# EAGLE board rekick2015-Prototyp (EAGLE 7.5.0)
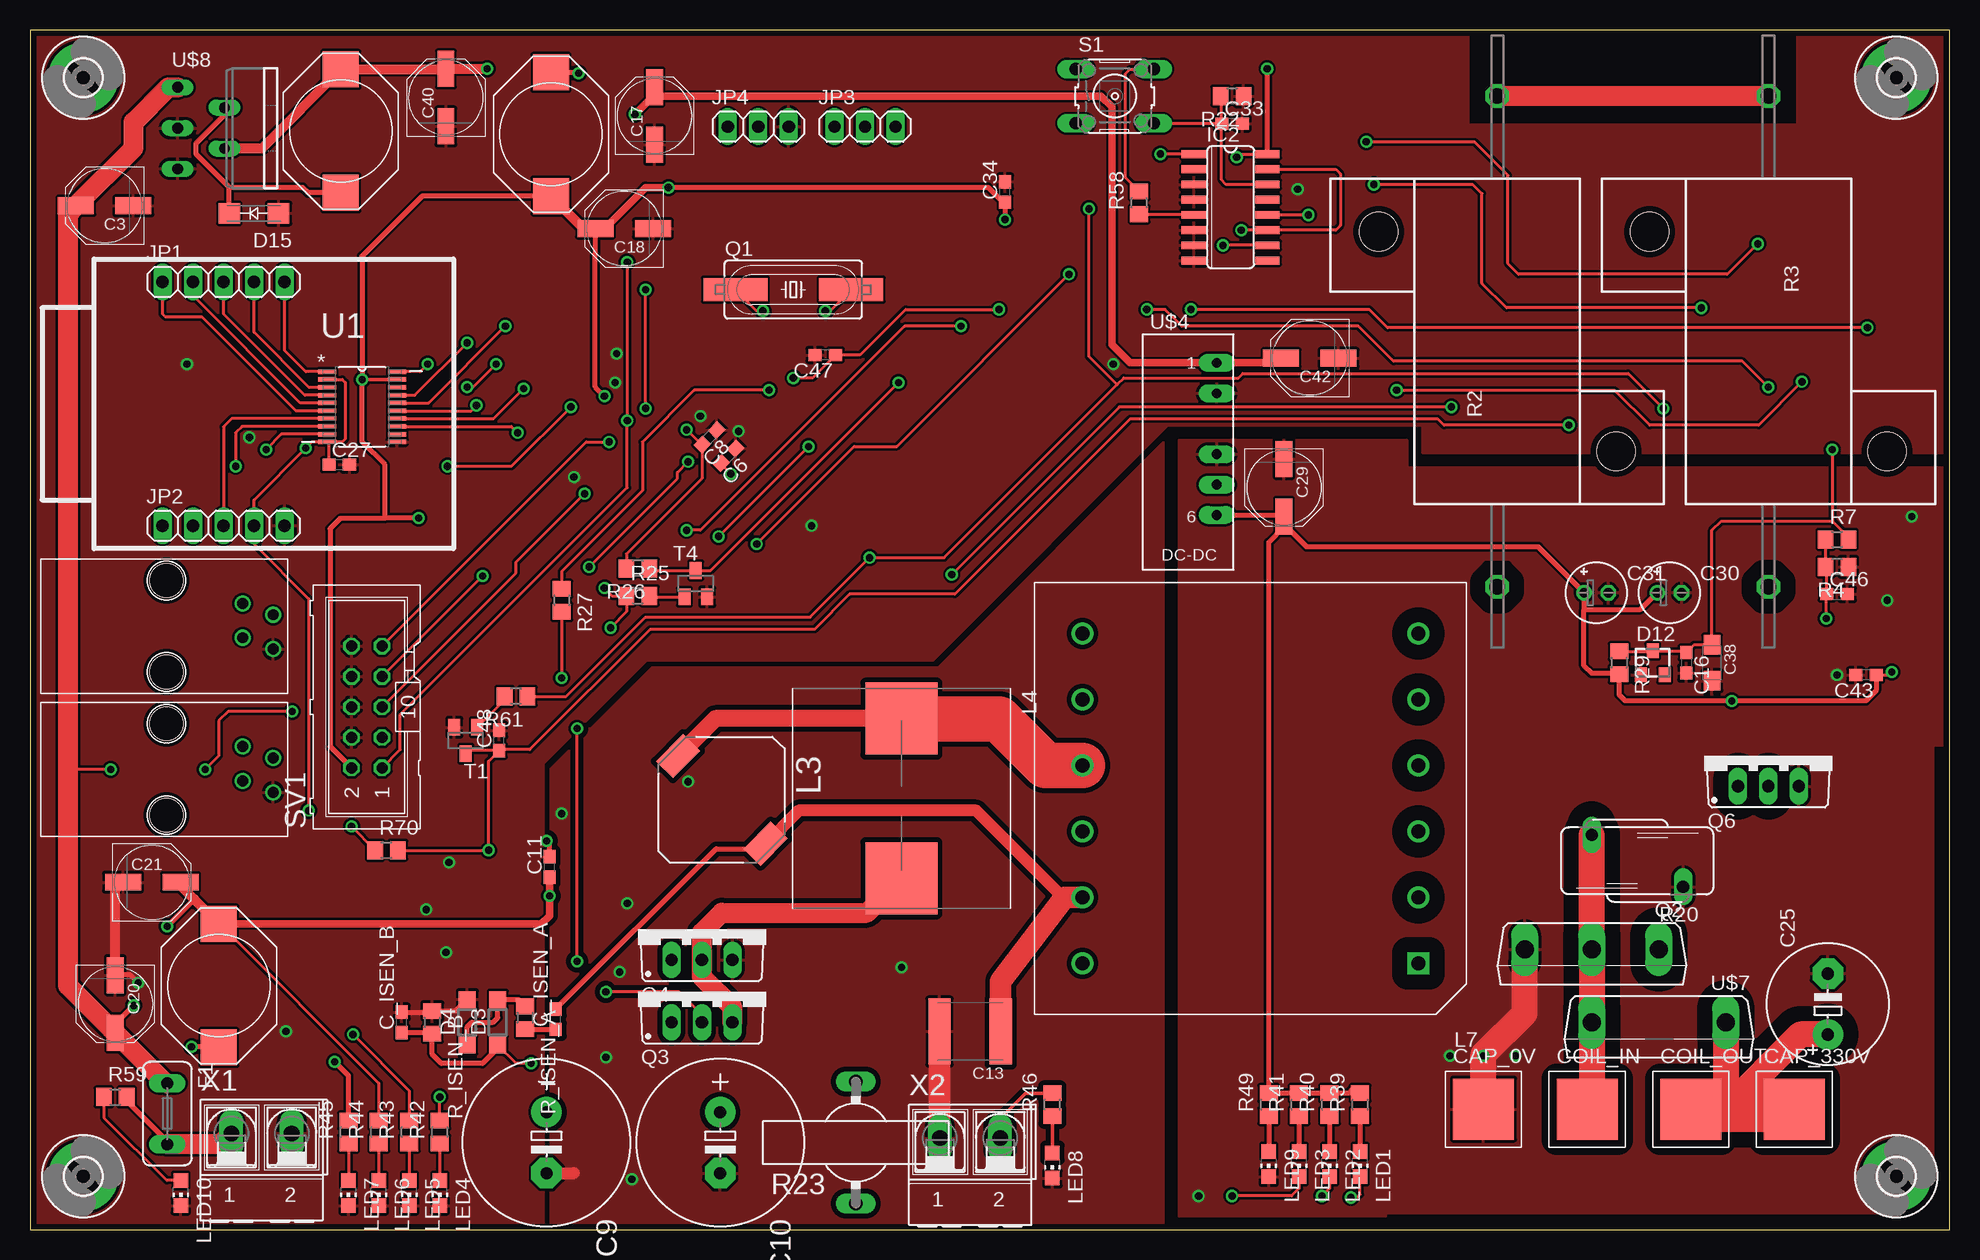
[diagram p7: board, top side]
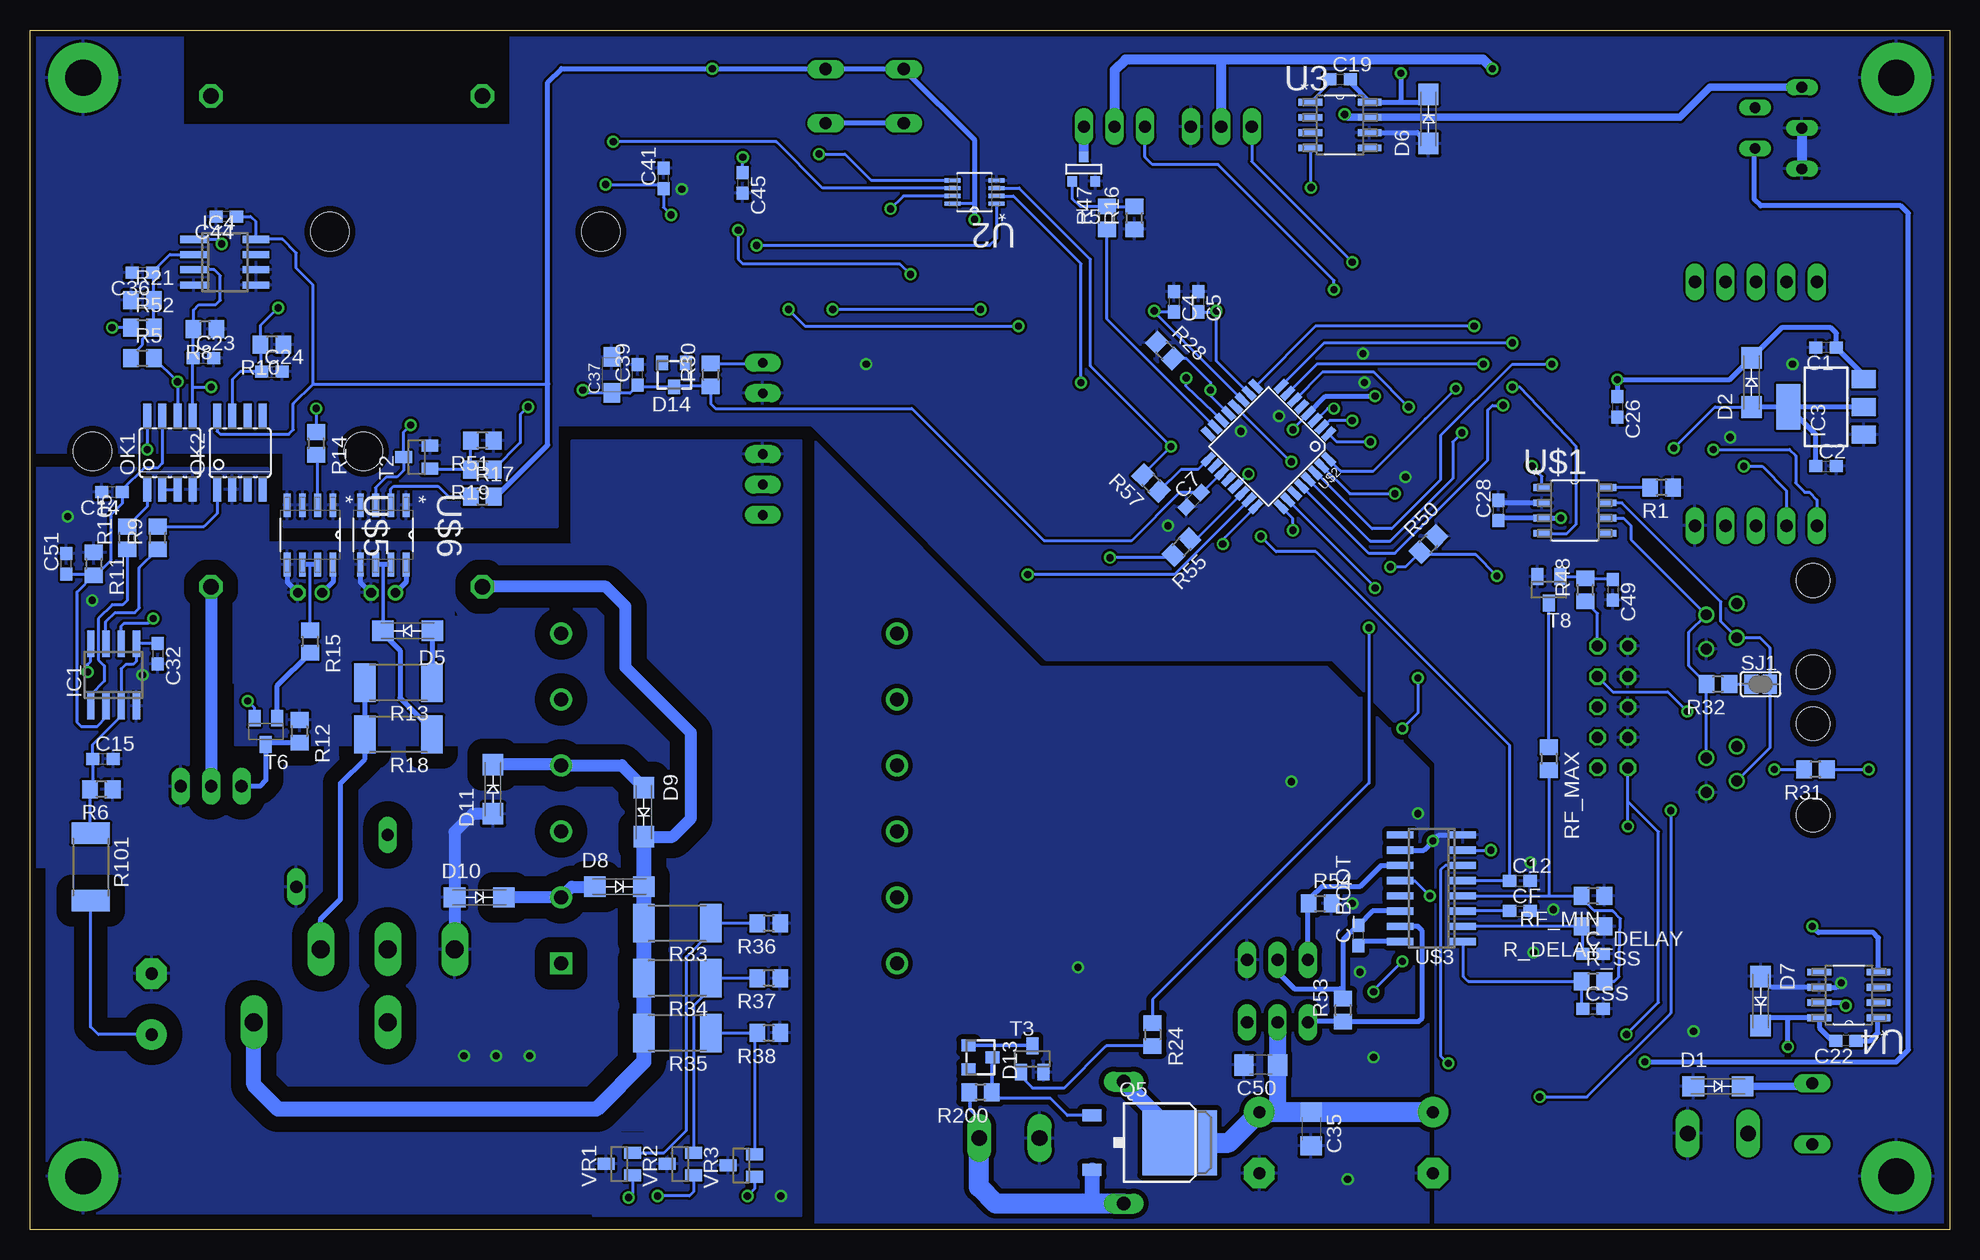
[diagram p8: board, bottom side, seen from below]

Size 160 x 100 mm. Coordinates in mm from the lower left corner, seen from the top.
Outline: 0,0 160,0 160,100 0,100 0,0
Copper layers (1*16): Top 0.035mm / dielectric 1.5mm / Bottom 0.035mm
Design rules "qp_designrules_8mil": minimum track width 8mil, minimum drill 20mil, track to track 8mil, track to pad 8mil, pad to pad 8mil, via to via 8mil, smd to smd 8mil, copper to edge 20mil, drill to drill 20mil, minimum pad ring 8mil, minimum via ring 8mil, stop-mask expansion 2mil, vias tented up to drill 0mil, thermal gap 10mil

## Footprints (pad centres in the part's own frame; a part is rotated, then mirrored left to right if it is on the bottom)
C0603 = smd 1.1 x 1: 1 -0.85,0; 2 0.85,0
PANASONIC_D = smd 3 x 1.4: + 2.4,0; - -2.4,0
E5-13 = drill 1.016 pad 2.54: + -2.54,0 | drill 1.016 pad 2.54 octagon: - 2.54,0
C2220K = smd 1.85 x 5.5: 1 -2.55,0; 2 2.55,0
E5-10,5 = drill 1.016 pad 2.54: + -2.54,0 | drill 1.016 pad 2.54 octagon: - 2.54,0
E2-5 = drill 0.813 pad 1.27: + -1.016,0 | drill 0.813 pad 1.27 octagon: - 1.016,0
C1206 = smd 1.6 x 1.8: 1 -1.4,0; 2 1.4,0
SMC_A = smd 1.6 x 1.4: + -1.5,0; - 1.5,0
5-5 = smd 5.08 x 5.08: P$1 0,0
SMA-DO214AC = smd 1.8 x 1.7: A -2.05,0; K 2.05,0
SOD123 = smd 1.4 x 1.4: A 1.9,0; C -1.9,0
TO236 = smd 1 x 1.2: A -1,-1; C 0,1; NC 1,-1
TE5 = drill 1.016 long: 1 -2.54,0; 2 2.54,0
3,0-PAD = drill 3 pad 5.842: B3,0 0,0
SO08 = smd 0.6 x 2.2: 1 -1.905,-2.6; 2 -0.635,-2.6; 3 0.635,-2.6; 4 1.905,-2.6; 5 1.905,2.6; 6 0.635,2.6; 7 -0.635,2.6; 8 -1.905,2.6
SO16 = smd 0.66 x 2.032: 1 -4.445,-3.073; 2 -3.175,-3.073; 3 -1.905,-3.073; 4 -0.635,-3.073; 5 0.635,-3.073; 6 1.905,-3.073; 7 3.175,-3.073; 8 4.445,-3.073; 9 4.445,3.073; 10 3.175,3.073; 11 1.905,3.073; 12 0.635,3.073; 13 -0.635,3.073; 14 -1.905,3.073; 15 -3.175,3.073; 16 -4.445,3.073
SOT223 = smd 1.5 x 2: 1 -2.3,-3.15; 2 0,-3.15; 3 2.3,-3.15 | smd 3.8 x 2: 4 0,3.15
1X05 = drill 1.016 long: 1 -5.08,0; 2 -2.54,0; 3 0,0; 4 2.54,0; 5 5.08,0
1X03 = drill 1.016 long: 1 -2.54,0; 2 0,0; 3 2.54,0
PISM = smd 3 x 3: 1 -5.15,0; 2 5.15,0
IND_ELLATP-B = smd 2 x 3.2 rotated 45: 1 -3.65,-3.65; 2 3.65,3.65
WE-HCI_1890 = smd 6 x 6: 1 -6.65,0; 2 6.65,0
WE-LLCR_ETD34 = drill 1.2 square: 1 -14,13.75 | drill 1.2: 2 -14,8.25; 3 -14,2.75; 4 -14,-2.75; 5 -14,-8.25; 6 -14,-13.75; 7 14,-13.75; 8 14,-8.25; 9 14,-2.75; 10 14,2.75; 11 14,8.25; 12 14,13.75
CHIP-LED0805 = smd 1.2 x 1.2: A 0,-1.05; C 0,1.05
SOIC08 = smd 0.66 x 2.032: 1 -1.905,-3.073; 2 -0.635,-3.073; 3 0.635,-3.073; 4 1.905,-3.073; 5 1.905,3.073; 6 0.635,3.073; 7 -0.635,3.073; 8 -1.905,3.073
HC49UP = smd 5.334 x 1.93: 1 -4.826,0; 2 4.826,0
TO247BV = drill 1.499 long: D 0,-2.921; G -5.588,-2.921; S 5.588,-2.921
TO220BV = drill 1.016 long: D 0,-2.54; G -2.54,-2.54; S 2.54,-2.54
D-PAK_TO252AA = smd 1 x 1.6: 1 -2.28,-4.8; 3 2.28,-4.8 | smd 5.4 x 6.2: 4 0,2.5
R0805 = smd 1.3 x 1.5: 1 -0.95,0; 2 0.95,0
HS25 = drill 1.3 octagon: 1 -20.47,0; 2 20.47,0 | hole 3.2: 9.15,9.9; -9.15,-9.9
R2512 = smd 1.8 x 3.2: 1 -2.8,0; 2 2.8,0
S10K385 = drill 1.016 long: 1 -2.159,-3.81; 2 2.159,3.81
N644A = drill 1.118 long: 1 -5.08,0; 2 5.08,0
RJ10 = drill 0.9: P$1 -1.905,6.55; P$2 -0.953,9.09; P$3 0.953,6.55; P$4 1.905,9.09 | hole 2.8: -3.81,0.2; 3.81,0.2
B3F-10XX = drill 1.016 long: 1 -3.251,2.261; 2 3.251,2.261; 3 -3.251,-2.261; 4 3.251,-2.261
SJ = smd 1.168 x 1.6: 1 -0.762,0; 2 0.762,0
ML10 = drill 0.914 octagon: 1 -5.08,-1.27; 2 -5.08,1.27; 3 -2.54,-1.27; 4 -2.54,1.27; 5 0,-1.27; 6 0,1.27; 7 2.54,-1.27; 8 2.54,1.27; 9 5.08,-1.27; 10 5.08,1.27
SOT23 = smd 1 x 1.4: 1 -0.95,-1.1; 2 0.95,-1.1; 3 0,1.1
SOT-23 = smd 0.787 x 0.889: 1 0.025,-1.016; 2 -0.94,1.016; 3 0.991,1.016
SOT23-BEC = smd 1 x 1.4: B -0.95,-1.1; C 0,1.1; E 0.95,-1.1
SOP65P640X120-20N = smd 1.473 x 0.356: 1 -2.921,2.921; 2 -2.921,2.286; 3 -2.921,1.626; 4 -2.921,0.965; 5 -2.921,0.33; 6 -2.921,-0.33; 7 -2.921,-0.965; 8 -2.921,-1.626; 9 -2.921,-2.286; 10 -2.921,-2.921; 11 2.921,-2.921; 12 2.921,-2.286; 13 2.921,-1.626; 14 2.921,-0.965; 15 2.921,-0.33; 16 2.921,0.33; 17 2.921,0.965; 18 2.921,1.626; 19 2.921,2.286; 20 2.921,2.921
SOP65P400X130-8N = smd 1.321 x 0.356: 1 -1.829,0.965; 2 -1.829,0.33; 3 -1.829,-0.33; 4 -1.829,-0.965; 5 1.829,-0.965; 6 1.829,-0.33; 7 1.829,0.33; 8 1.829,0.965
SOIC127P620X175-8N = smd 1.981 x 0.559: 1 -2.464,1.905; 2 -2.464,0.635; 3 -2.464,-0.635; 4 -2.464,-1.905; 5 2.464,-1.905; 6 2.464,-0.635; 7 2.464,0.635; 8 2.464,1.905
SOIC127P600X175-8N = smd 1.473 x 0.559: 1 -2.718,1.905; 2 -2.718,0.635; 3 -2.718,-0.635; 4 -2.718,-1.905; 5 2.718,-1.905; 6 2.718,-0.635; 7 2.718,0.635; 8 2.718,1.905
TQFP32-08 = smd 1.27 x 0.559: 1 -4.293,2.8; 2 -4.293,2; 3 -4.293,1.2; 4 -4.293,0.4; 5 -4.293,-0.4; 6 -4.293,-1.2; 7 -4.293,-2; 8 -4.293,-2.8; 17 4.293,-2.8; 18 4.293,-2; 19 4.293,-1.2; 20 4.293,-0.4; 21 4.293,0.4; 22 4.293,1.2; 23 4.293,2; 24 4.293,2.8 | smd 0.559 x 1.27: 9 -2.8,-4.293; 10 -2,-4.293; 11 -1.2,-4.293; 12 -0.4,-4.293; 13 0.4,-4.293; 14 1.2,-4.293; 15 2,-4.293; 16 2.8,-4.293; 25 2.8,4.293; 26 2,4.293; 27 1.2,4.293; 28 0.4,4.293; 29 -0.4,4.293; 30 -1.2,4.293; 31 -2,4.293; 32 -2.8,4.293
SO16' = smd 0.6 x 2.2: 1 -4.445,-2.6; 2 -3.175,-2.6; 3 -1.905,-2.6; 4 -0.635,-2.6; 5 0.635,-2.6; 6 1.905,-2.6; 7 3.175,-2.6; 8 4.445,-2.6; 9 4.445,2.6; 10 3.175,2.6; 11 1.905,2.6; 12 0.635,2.6; 13 -0.635,2.6; 14 -1.905,2.6; 15 -3.175,2.6; 16 -4.445,2.6
TMH-D = drill 0.8 pad 1.5 long: 1 0,6.35; 2 0,3.81; 4 0,-1.27; 5 0,-3.81; 6 0,-6.35
SOIC-8 = smd 1.981 x 0.559: 1 -2.464,1.905; 2 -2.464,0.635; 3 -2.464,-0.635; 4 -2.464,-1.905; 5 2.464,-1.905; 6 2.464,-0.635; 7 2.464,0.635; 8 2.464,1.905
TO247AD = drill 1.499 long: A 5.588,-2.921; C -5.588,-2.921
TO220511 = drill 0.9 long: 1 -3.4,-8.4; 2 -1.7,-4.5; 3 0,-8.4; 4 1.7,-4.5; 5 3.4,-8.4
AK500/2-H = drill 1.321 long: 1 -2.515,0; 2 2.515,0

## Placement (x,y rotation side)
C1  10µ/10V  [C0603]  10.29,73.53 180 bottom
C2  10µ/10V  [C0603]  10.29,63.63 0 bottom
C3  47µ/35V  [PANASONIC_D]  6.22,85.34 180 top
C4  22p  [C0603]  64.64,77.34 270 bottom
C5  22p  [C0603]  62.61,77.34 270 bottom
C6  100n  [C0603]  58.2,64.5 225 top
C7  100n  [C0603]  62.99,60.83 45 bottom
C8  100n  [C0603]  56.64,66.04 225 top
C9  2200µ/50V  [E5-13]  43.05,7.24 270 top
C10  2200µ/50V  [E5-13]  57.53,7.24 270 top
C11  100n  [C0603]  43.31,30.23 90 top
C12  100n  [C0603]  35.81,29.08 0 bottom
C13  2.2µ/250V  [C2220K]  78.36,16.51 180 top
C14  100n  [C0603]  153.16,61.47 180 bottom
C15  100n  [C0603]  153.92,39.24 0 bottom
C16  100n  [C0603]  138.05,47.24 270 top
C17  47µ/35V  [PANASONIC_D]  52.07,92.84 90 top
C18  47µ/35V  [PANASONIC_D]  49.53,83.44 180 top
C19  10n/35V  [C0603]  50.8,95.89 0 bottom
C20  47µ/35V  [PANASONIC_D]  7.11,18.8 270 top
C21  47µ/35V  [PANASONIC_D]  10.16,28.96 0 top
C22  10n/35V  [C0603]  8.64,15.75 180 bottom
C23  100n  [C0603]  145.54,72.64 0 bottom
C24  100n  [C0603]  139.83,71.5 0 bottom
C25  10µ/450V  [E5-10,5]  149.86,18.8 90 top
C26  100n  [C0603]  27.69,68.58 270 bottom
C27  100n  [C0603]  25.78,63.75 0 top
C28  100n  [C0603]  37.59,59.94 90 bottom
C29  47µ/35V  [PANASONIC_D]  104.52,61.85 270 top
C30  47µ/35V  [E2-5]  136.65,53.09 0 top
C31  47µ/35V  [E2-5]  130.56,53.09 0 top
C32  100n  [C0603]  149.35,48.01 270 bottom
C33  100n  [C0603]  100.2,92.2 0 top
C34  100n  [C0603]  81.28,86.49 90 top
C35  1µ/50V  [C1206]  53.21,8.38 270 bottom
C36  100n  [C0603]  150.62,79.76 180 bottom
C37  1µ/25V  [SMC_A]  111.51,71.25 90 bottom
C38  1µ/25V  [SMC_A]  140.21,47.24 270 top
C39  100n  [C0603]  109.35,71.25 90 bottom
C40  47µ/35V  [PANASONIC_D]  34.67,94.36 90 top
C41  100n  [C0603]  107.19,87.63 90 bottom
C42  47µ/35V  [PANASONIC_D]  106.68,72.64 180 top
C43  100n  [C0603]  153.03,46.23 180 top
C44  100n  [C0603]  143.64,84.45 180 bottom
C45  100n  [C0603]  100.58,87.25 270 bottom
C46  100n  [C0603]  150.62,52.96 0 top
C47  100n  [C0603]  66.29,72.9 180 top
C48  100n  [C0603]  39.12,40.77 90 top
C49  10µ/10V  [C0603]  28.07,53.34 270 bottom
C50  1µ/50V  [C1206]  57.4,13.72 180 bottom
C51  100n  [C0603]  156.97,55.5 90 bottom
C_BOOT  100n  [C0603]  49.28,24.51 90 bottom
C_DELAY  10µ/10V  [C0603]  29.72,22.99 0 bottom
C_ISEN_A  22n/50V  [C0603]  43.81,17.53 90 top
C_ISEN_B  62n/10V  [C0603]  30.99,17.27 90 top
CAP_0V  WIREPADSMD5-5  [5-5]  121.16,10.03 270 top
CAP_330V  WIREPADSMD5-5  [5-5]  147.07,10.03 270 top
CF  470p  [C0603]  35.81,26.54 0 bottom
COIL_IN  WIREPADSMD5-5  [5-5]  129.79,10.03 270 top
COIL_OUT  WIREPADSMD5-5  [5-5]  138.43,10.03 270 top
CSS  1µ/10V  [C0603]  29.72,18.41 0 bottom
D1  ES1A  [SMA-DO214AC]  19.3,11.94 0 bottom
D2  ES1A  [SMA-DO214AC]  16.51,70.61 90 bottom
D3  MBR0520LT  [SOD123]  38.99,17.27 90 top
D4  MBR0520LT  [SOD123]  36.45,17.27 90 top
D5  ES1A  [SMA-DO214AC]  128.52,49.91 180 bottom
D6  ES1A  [SMA-DO214AC]  43.43,92.58 90 bottom
D7  ES1A  [SMA-DO214AC]  15.75,19.05 270 bottom
D8  STTH1R06A  [SMA-DO214AC]  110.87,28.57 0 bottom
D9  STTH1R06A  [SMA-DO214AC]  108.84,34.8 270 bottom
D10  STTH1R06A  [SMA-DO214AC]  122.56,27.69 0 bottom
D11  STTH1R06A  [SMA-DO214AC]  121.41,36.7 90 bottom
D12  BZX84-A5V1  [TO236]  135.25,47.24 0 top
D13  SMD ZD 12  [TO236]  80.77,14.35 270 bottom
D14  BZX84-A5V1  [TO236]  106.3,71.25 180 bottom
D15  ES1A  [SMA-DO214AC]  18.67,84.71 180 top
F1  FUSETE5  [TE5]  11.43,9.65 270 top
H1  MOUNT-PAD-ROUND3.0  [3,0-PAD]  155.57,4.45 0 top
H2  MOUNT-PAD-ROUND3.0  [3,0-PAD]  155.57,96.01 0 top
H3  MOUNT-PAD-ROUND3.0  [3,0-PAD]  4.45,96.01 0 top
H4  MOUNT-PAD-ROUND3.0  [3,0-PAD]  4.45,4.45 0 top
IC1  LM1458D  [SO08]  153.03,46.23 0 bottom
IC2  4043D  [SO16]  100.08,85.22 270 top
IC3  LM1117  [SOT223]  10.29,68.58 90 bottom
IC4  LM1458D  [SO08]  143.76,80.64 270 bottom
JP1  [1X05]  16.13,78.99 0 top
JP2  [1X05]  16.13,58.67 0 top
JP3  [1X03]  69.6,91.95 0 top
JP4  [1X03]  60.71,91.95 0 top
L1  68µH  [PISM]  25.91,91.57 270 top
L3  3.3UH  [IND_ELLATP-B]  57.66,35.81 270 top
L4  820n  [WE-HCI_1890]  72.64,35.94 270 top
L5  100µH  [PISM]  43.43,91.31 90 top
L6  150µH  [PISM]  15.75,20.32 270 top
L7  WE-LLCR  [WE-LLCR_ETD34]  101.73,35.94 180 top
LED1  [CHIP-LED0805]  110.87,5.46 180 top
LED2  [CHIP-LED0805]  108.33,5.46 180 top
LED3  [CHIP-LED0805]  105.79,5.46 180 top
LED4  [CHIP-LED0805]  34.16,3.05 180 top
LED5  [CHIP-LED0805]  31.62,3.05 180 top
LED6  [CHIP-LED0805]  29.08,3.05 180 top
LED7  [CHIP-LED0805]  26.54,3.05 180 top
LED8  [CHIP-LED0805]  85.22,5.33 180 top
LED9  [CHIP-LED0805]  103.25,5.46 180 top
LED10  [CHIP-LED0805]  12.57,3.05 180 top
OK1  ILD213  [SOIC08]  148.34,64.77 0 bottom
OK2  ILD213  [SOIC08]  142.49,64.77 0 bottom
Q1  16MHz  [HC49UP]  63.63,78.36 0 top
Q2  IGW60T120  [TO247BV]  130.18,20.45 180 top
Q3  IPP023N10N5  [TO220BV]  56.01,19.81 0 top
Q4  IPP023N10N5  [TO220BV]  56.01,25.02 0 top
Q5  IPD90P04P4L  [D-PAK_TO252AA]  66.67,7.24 270 bottom
Q6  IRF840  [TO220BV]  144.91,39.5 0 top
R1  1k  [R0805]  24,61.85 180 bottom
R2  100  [HS25]  122.3,74.04 90 top
R3  100  [HS25]  144.91,74.04 270 top
R4  24k, 1%  [R0805]  150.62,55.24 180 top
R5  10k, 1%  [R0805]  150.62,72.64 0 bottom
R6  12k, 1%  [R0805]  154.05,36.7 180 bottom
R7  5.6k, 1%  [R0805]  150.62,57.53 0 top
R8  10k, 1%  [R0805]  145.41,75.06 180 bottom
R9  2k  [R0805]  149.35,57.66 90 bottom
R10  5,6k  [R0805]  139.83,73.79 180 bottom
R11  10k, 1%  [R0805]  154.69,55.5 270 bottom
R12  10k  [R0805]  137.54,41.53 270 bottom
R13  5  [R2512]  129.29,45.59 180 bottom
R14  390  [R0805]  136.14,65.53 270 bottom
R15  10k  [R0805]  136.65,49.02 270 bottom
R16  50k  [R0805]  67.94,84.33 90 bottom
R17  390  [R0805]  122.3,61.09 0 bottom
R18  5  [R2512]  129.29,41.27 180 bottom
R19  5,6k  [R0805]  122.3,63.37 180 bottom
R20  ERZE07A621  [S10K385]  133.99,30.73 90 top
R21  33k, 1%  [R0805]  150.62,77.47 0 bottom
R22  10k  [R0805]  100.2,94.49 180 top
R23  [N644A]  68.83,7.24 90 top
R24  5,6k  [R0805]  66.42,16.26 270 bottom
R25  100k  [R0805]  50.67,52.83 0 top
R26  50k  [R0805]  50.67,55.12 180 top
R27  50k  [R0805]  44.32,52.45 270 top
R28  5,6k  [R0805]  65.41,73.28 315 bottom
R29  1k  [R0805]  132.46,47.24 270 top
R30  3.3k  [R0805]  103.25,71.25 90 bottom
R31  50k  [R0805]  11.18,38.35 180 bottom
R32  120  [R0805]  19.3,45.47 180 bottom
R33  1M  [R2512]  106.05,25.53 180 bottom
R34  1M  [R2512]  106.05,20.95 180 bottom
R35  1M  [R2512]  106.05,16.38 180 bottom
R36  50k  [R0805]  98.42,25.53 180 bottom
R37  16.9k  [R0805]  98.42,20.95 180 bottom
R38  7.68k  [R0805]  98.42,16.38 180 bottom
R39  4.7k  [R0805]  110.87,10.41 90 top
R40  4.7k  [R0805]  108.33,10.41 90 top
R41  4.7k  [R0805]  105.79,10.41 90 top
R42  680  [R0805]  34.16,8.13 90 top
R43  1,5k  [R0805]  31.62,8.13 90 top
R44  4.7k  [R0805]  29.08,8.13 90 top
R45  1,5k  [R0805]  26.54,8.13 90 top
R46  10k  [R0805]  85.22,10.41 90 top
R47  5,6k  [R0805]  70.23,84.33 90 bottom
R48  5,6k  [R0805]  30.35,53.34 90 bottom
R49  4.7k  [R0805]  103.25,10.41 90 top
R50  5,6k  [R0805]  43.43,57.15 45 bottom
R51  50k  [R0805]  122.3,65.79 180 bottom
R52  5,6k, 1%  [R0805]  150.62,75.18 0 bottom
R53  100k  [R0805]  50.55,18.29 90 bottom
R54  100k  [R0805]  52.45,27.18 0 bottom
R55  5,6k  [R0805]  64.01,56.9 225 bottom
R57  5,6k  [R0805]  66.55,62.23 135 bottom
R58  10k  [R0805]  92.46,85.6 90 top
R59  10k  [R0805]  7.11,11.05 0 top
R61  5,6k  [R0805]  40.51,44.45 180 top
R70  10k  [R0805]  29.72,31.62 0 top
R101  1M, 1%  [R2512]  154.94,30.23 270 bottom
R105  680  [R0805]  151.89,57.66 90 bottom
R200  50k  [R0805]  80.77,11.43 180 bottom
R_DELAY  [R0805]  29.72,25.27 180 bottom
R_ISEN_A  33k  [R0805]  41.27,17.65 270 top
R_ISEN_B  2k  [R0805]  33.53,17.27 270 top
R_SS  3.3k, 1%  [R0805]  29.72,20.7 0 bottom
RF_MAX  33k  [R0805]  33.4,39.24 270 bottom
RF_MIN  12k  [R0805]  29.72,27.81 180 bottom
RJ_1  RJ10  [RJ10]  11.18,38.35 270 top
RJ_2  RJ10  [RJ10]  11.18,50.29 270 top
S1  [B3F-10XX]  90.42,94.49 0 top
SJ1  [SJ]  15.75,45.47 0 bottom
SV1  [ML10]  28.07,43.56 90 top
T1  BC849  [SOT23]  36.32,40.77 180 top
T2  BC849  [SOT23]  127.76,64.39 90 bottom
T3  BC849  [SOT23]  76.45,14.22 0 bottom
T4  BC849  [SOT23]  55.5,53.85 0 top
T5  IRLML6344TRPBF  [SOT-23]  72.14,88.39 180 bottom
T6  BC859  [SOT23-BEC]  140.34,41.53 180 bottom
T8  BC849  [SOT23]  33.4,53.34 180 bottom
U1  TXB0108PWR  [SOP65P640X120-20N]  27.69,68.58 0 top
U2  SN74LVC2G02DCTR  [SOP65P400X130-8N]  81.28,86.49 180 bottom
U3  LM2675  [SOIC127P620X175-8N]  50.8,92.08 0 bottom
U4  LM2675  [SOIC127P620X175-8N]  8.38,19.56 180 bottom
U$1  MCP2551-I/SN  [SOIC127P600X175-8N]  31.24,59.94 0 bottom
U$2  ATMEGA64M1  [TQFP32-08]  56.77,65.28 225 bottom
U$3  L6599  [SO16']  43.18,28.45 90 bottom
U$4  TMH-D  [TMH-D]  98.93,65.91 0 top
U$5  SI8261ABC  [SOIC-8]  136.65,57.91 270 bottom
U$6  SI8261ABC  [SOIC-8]  130.56,57.91 270 bottom
U$7  DSEI30-12A  [TO247AD]  135.76,14.35 180 top
U$8  LM2576  [TO220511]  20.7,91.82 270 top
VR1  TL431_SOT23  [SOT23]  110.87,5.46 90 bottom
VR2  TL431_SOT23  [SOT23]  105.79,5.46 90 bottom
VR3  TL431_SOT23  [SOT23]  100.71,5.33 90 bottom
X1  [AK500/2-H]  19.3,8 0 top
X2  [AK500/2-H]  78.36,7.62 0 top

## Tracks (layer width: path | path; a pad name or v marks a point on that pad's centre or on a via)
24V_PRI  (via drill 0.6)
  Top 0.254: Q3.D 56.01,17.91 54.1,19.81 v48.01,19.81 | v45.59,22.35 v45.59,41.78 | R27.2 v44.32,45.97
  Bottom 0.254: v48.01,19.81 48.01,19.94 v45.59,22.35 | 55.97,13.46 56.01,13.46 C50.1 | v44.32,45.97 44.32,43.05 v45.59,41.78 | C35.1 54.73,9.78 54.74,9.78
  Bottom 1.27: R23.2 64.17,7.66 Q5.4
  Bottom 1.422: Q3.D 56.01,13.46 56.01,10.03 55.75,9.78
  Bottom 1.676: C9.+ 54.74,9.78 55.75,9.78 C10.+ 60.07,7.24 Q5.4
+3V3  (via drill 0.6)
  Top 0.254: U1.2 26.04,70.87 26.29,70.61 26.29,65.91 26.04,65.66 U1.10 | v23.24,34.92 23.24,52.58 18.67,57.15 JP2.4 18.67,60.83 v22.99,65.15 23.5,65.66 U1.10 | R42.2 v34.16,11.05 | C27.1 24.93,65.49 U1.10
  Bottom 0.254: v23.24,34.92 23.24,18.03 30.23,11.05 v34.16,11.05 | v22.99,65.15 19.56,68.58 16.53,68.58 D2.A
  Bottom 0.406: IC3.2 IC3.4 | IC3.4 16.49,68.58 D2.A | C2.1 11.14,66.28 IC3.4
+5V  (via drill 0.6)
  Top 0.254: v26.92,16.26 31.62,11.56 R43.2 | R70.1 v26.8,33.59 | R26.2 49.72,56.33 56.01,62.61 56.01,65.41 C8.2 55.97,65.44 v54.74,66.67 | v100.58,89.41 100.84,89.66 IC2.16 | R58.2 91.31,87.69 91.31,96.37 91.69,96.75 S1.2
  Top 0.305: U1.19 v27.69,70.87
  Top 0.406: 43.43,86.23 L5.1 32.7,86.16 27.69,81.15 v27.69,70.87 27.69,65.66 29.59,63.75 29.59,59.31 | C18.+ 47.13,81.39 47.12,81.38 47.12,70.23 v47.88,69.47 | v32.38,59.31 29.59,59.31 | SV1.2 25.02,40.26 25.02,58.42 25.91,59.31 29.59,59.31 | IC2.16 103.15,96.75 v103.12,96.77 | v81.28,84.2 C34.1 81.11,85.64 79.88,86.87 v53.21,86.87
  Top 0.61: C18.+ 47.88,83.44 51.31,86.87 v53.21,86.87
  Top 0.813: C18.+ 46.16,83.44 L5.1
  Bottom 0.254: v53.21,86.87 53.21,90.12 U3.4 | v26.92,16.26 24.26,18.92 24.26,33.15 26.8,35.69 | 26.8,35.69 SV1.2 | v26.8,33.59 26.8,35.69 | C45.1 v100.58,89.41 | OK2.8 144.4,66.55 144.15,66.29 138.43,66.29 138.05,66.67 138.05,68.83 136.4,70.48 | 136.4,70.48 116.84,70.48 | C44.1 141.6,84.45 141.16,84.01 IC4.8 138.94,82.55 137.79,81.41 137.79,80.14 136.4,78.74 136.4,70.48 | 81.28,85.52 U2.8 | U$2.4 54.74,66.74 v54.74,66.67
  Bottom 0.406: IC3.3 7.14,71.23 C1.1 9.44,74.72 9.91,75.18 13.99,75.18 D2.K 18.31,70.87 v27.69,70.87 C26.1 | 37.88,59.09 C28.1 37.38,59.31 U$1.3 v32.38,59.31 | U$2.4 52.01,69.47 v47.88,69.47 | R17.2 121.16,61.09 116.84,65.41 116.84,70.48 116.84,95.63 115.7,96.77 v103.12,96.77 93.7,96.77 S1.2 S1.1 81.28,90.86 81.28,85.52 v81.28,84.2
+5V/1  (via drill 0.6)
  Top 0.406: R45.2 26.54,12.83 v25.4,13.97
  Top 0.813: U$8.4 19.31,90.12 L1.1 34.63,96.72 C40.+ 38.09,96.76 v38.1,96.77
  Bottom 0.406: v25.4,13.97 4.45,13.97 3.43,14.99 3.43,84.71 4.06,85.34 15.75,85.34 16.26,85.85 16.26,90.07 U$8.4
  Bottom 0.813: v38.1,96.77 38.86,97.54 60.71,97.54 | 60.71,97.54 68.71,97.54 69.6,96.65 JP3.2 | JP4.2 60.71,97.54
+5V/3  (via drill 0.6)
  Top 0.254: v147.7,70.67 144.08,67.06 135,67.06 132.08,69.98 v113.92,69.98
  Bottom 0.254: U$2.19 62.31,61.43 C7.2 64.17,61.43 68.2,57.4 75.44,57.4 86.49,68.45 102.87,68.45 103.25,68.83 R30.1 106.25,70.3 D14.C 109.2,70.25 C39.1 109.35,70.36 109.98,69.72 111.48,69.72 C37.+ 113.69,69.75 v113.92,69.98 | R5.2 v147.7,70.67 OK1.6
+5V/4  (via drill 0.6)
  Top 0.254: v150.24,65.02 150.24,59.05 | 150.24,59.05 151.26,58.04 151.26,57.85 R7.2 | R29.1 135.21,48.19 D12.C 137.9,48.24 C16.1 138.7,48.74 C38.+ 140.21,58.29 140.97,59.05 150.24,59.05
  Bottom 0.254: OK1.8 v150.24,65.02
+12V  (via drill 0.6)
  Top 0.254: L6.1 15.8,25.47 29.08,12.19 R44.2
  Top 0.406: v11.43,25.27 13.69,27.53
  Top 0.61: L6.1 42.62,25.47 43.31,26.16 v43.31,27.81 43.31,28.07 C11.1
  Top 0.813: C21.+ 12.56,28.66 13.69,27.53 L6.1
  Bottom 0.254: U$3.12 44.58,29.08 v43.31,27.81
  Bottom 0.406: U4.4 5.92,24.33 6.35,24.77 10.92,24.77 v11.43,25.27
+24V  (via drill 0.6)
  Top 0.254: 3.3,50.29 3.17,50.42 | v6.73,38.35 3.3,38.35 3.17,38.48
  Top 0.305: 52.2,94.49 52.07,94.61
  Top 0.406: v8.64,18.67 6.74,16.77
  Top 0.61: v50.42,92.96 52.07,94.61 C17.+ | C42.+ 103.9,72.26 U$4.1 91.69,72.26 90.17,73.79 90.17,93.6 89.28,94.49 52.2,94.49
  Top 1.676: U$8.1 11.53,95.22 8.64,92.33 8.64,90.16 C3.+ 3.17,84.7 3.17,50.42 3.17,38.48 3.17,20.33 6.74,16.77 C20.+ 11.32,12.19 F1.1
  Bottom 0.254: R30.2 99,72.2 U$4.1 | R31.1 v6.73,38.35
  Bottom 0.406: U4.7 8.89,18.92 v8.64,18.67
  Bottom 0.61: U$8.1 19.97,95.22 22.48,92.71 U3.7 50.16,92.71 v50.42,92.96 | D1.K 11.68,11.94 F1.1
ACTIVATE_BOOSTER  (via drill 0.6)
  Top 0.254: v48.39,50.16 49.72,51.5 R25.1 48.51,52.83 v47.88,53.47
  Bottom 0.254: R24.1 66.42,19.18 48.39,37.21 v48.39,50.16 | U$2.26 47.88,53.56 v47.88,53.47
ACTIVATE_SERVO
  Bottom 0.254: U$2.15 70.23,75.91 R47.1
ADC_24V_LOGIK/SCK_A  (via drill 0.6)
  Top 0.254: v21.84,43.18 16.51,43.18 15.75,42.42 15.75,39.5 v14.61,38.35 | SV1.7 v37.72,54.48 | v46.61,55.24 53.98,62.61 53.98,63.12 v54.86,64.01
  Bottom 0.254: U$2.12 54.93,64.01 v54.86,64.01 | SV1.7 28.07,44.83 23.5,44.83 v21.84,43.18 | v14.61,38.35 R31.2 | v37.72,54.48 39.5,56.26 43.43,56.26 43.65,56.48 R50.1 45.34,55.24 v46.61,55.24
ADC_24V_PRI  (via drill 0.6)
  Top 0.254: v61.59,69.98 55.37,69.98 51.05,65.66 51.05,61.59 44.32,54.86 R27.1
  Bottom 0.254: U$2.13 61.59,69.54 v61.59,69.98 61.59,70.61 63.63,72.64 64.7,72.64 R28.2
ADC_CAP  (via drill 0.6)
  Top 0.254: v144.91,70.23 142.75,72.39 113.67,72.39 110.74,75.31 96.01,75.31 94.61,76.71 v93.09,76.71 | v80.77,76.71 72.99,76.71 69.18,72.9 C47.1 65.24,70.99 v63.63,70.99
  Bottom 0.254: 146.43,70.23 146.43,72.61 C23.1 146.39,75.03 R8.2 146.37,76.65 145.92,77.09 144.53,77.09 144.15,77.47 144.15,79.5 144.65,80.01 IC4.3 | OK1.5 146.43,70.23 | 146.43,70.23 v144.91,70.23 | U$2.14 63.63,70.31 v63.63,70.99 | v80.77,76.71 v93.09,76.71
BOOSTER_24V
  Top 0.305: R46.2 82.99,11.36 80.87,9.25 X2.2
  Bottom 0.305: X2.2 80.87,9.25 81.66,10.03 81.66,11.37 R200.2
  Bottom 1.27: Q5.3 71.47,2.57 71.88,2.16
  Bottom 1.676: R23.1 71.88,2.16 73.15,2.16 | 73.15,2.16 79.5,2.16 80.9,3.56 80.9,7.59 X2.2 | 73.13,2.19 73.15,2.16
CAN_H
  Bottom 0.254: RJ_1.P$3 14.99,40.14 SJ1.2 14.99,48.51 15.81,49.34 RJ_2.P$3 19.05,50.67 19.05,52.32 27.3,60.58 U$1.7
CAN_L
  Bottom 0.254: RJ_1.P$2 20.27,45.45 R32.2 20.25,45.53 21.72,46.99 21.72,49.79 RJ_2.P$2 26.54,57.52 26.54,58.67 27.18,59.31 U$1.6
CAN_RX  (via drill 0.6)
  Top 0.254: v36.45,70.23 36.96,70.23 v38.86,72.14
  Bottom 0.254: U$1.4 31.88,58.04 31.11,58.8 31.11,65.28 35.81,70.23 v36.45,70.23 | v38.86,72.14 52.74,72.14 U$2.7
CAN_TX  (via drill 0.6)
  Top 0.254: v34.8,63.63 40.13,63.63 v45.09,68.58
  Bottom 0.254: U$1.1 33.96,62.79 v34.8,63.63 | U$2.6 52.24,71.5 48.01,71.5 v45.09,68.58
CAP_0V  (via drill 0.6)
  Top 2.184: CAP_0V.P$1 v121.16,14.48 121.16,14.61 124.59,18.03 Q2.S
  Bottom 0.406: U$6.5 132.46,53.98 C31.- | U$5.5 138.56,53.98 C30.-
  Bottom 1.016: Q2.S 124.59,27.67 D10.A 124.61,33.13 123.06,34.67 121.41,34.67 D11.A
  other vias: 97.41,2.79 118.36,14.48 123.83,14.48 154.81,52.45 150.62,46.23 156.84,59.44
  pour Top (isolate 1.27, rank 5): 160.02,63.5 160.02,0 95.76,0 95.76,65.79 114.81,65.79 114.81,63.5
  pour Bottom (isolate 1.27, rank 5): 160.02,63.37 160.02,0 95.76,0 95.76,65.79 114.81,65.79 114.81,57.28 140.21,57.28 140.21,63.37
  pour Top: 95.76,65.79 95.76,1.14 113.03,1.14 113.03,15.62 106.43,15.62 106.43,53.59 114.81,53.59 114.81,55.37 120.78,55.37 121.28,55.88 123.32,55.88 123.83,55.37 124.71,55.37 124.71,40.39 160.02,40.39 160.02,49.4 142.49,49.4 142.49,56.01 147.32,56.01 147.32,49.53 160.02,49.53 160.02,63.5 114.81,63.5 114.81,65.79
  pour Bottom: 147.32,56.01 147.32,30.23 160.02,30.23 160.02,63.5 140.21,63.5 140.21,57.28 124.71,57.28 124.71,51.05 124.08,51.05 124.08,40.39 142.88,40.39 142.88,45.59 142.49,45.59 142.49,56.01
  pour Bottom: 114.81,57.28 114.81,65.79 95.76,65.79 95.76,1.14 113.03,1.14 113.03,8 107.95,8 106.55,9.4 106.55,28.07 101.6,32.89 101.6,48.77 110.11,57.28
CAP_330V
  Top 2.184: U$7.C 141.35,10.16 | C25.+ 147.57,16.26 141.35,10.03
  Top 2.54: 141.35,10.16 141.48,10.03
  Top 3.81: COIL_OUT.P$1 141.35,10.03 141.48,10.03 CAP_330V.P$1
  Bottom 0.254: C25.+ 154.31,16.26 154.94,16.89 R101.2
  Bottom 1.016: D9.K 106.44,32.75 104.9,34.29 104.9,41.4 110.36,46.86 110.36,51.94 112.01,53.59 122.28,53.59 R2.1
  Bottom 1.27: D9.K 108.84,28.59 D8.K 108.84,28.55 R33.2 | 108.82,25.55 R33.2 | R33.2 R34.2 R35.2 108.84,13.96 112.78,10.03 139.32,10.03 141.35,12.06 U$7.C
CAP_+12V  (via drill 0.6)
  Top 0.254: C43.1 154.94,46.23 v155.19,46.48 | 132.4,46.35 R29.2
  Top 0.406: R39.2 110.36,11.36 | 110.36,11.36 R40.2 R41.2 R49.2 103.25,57.28 104.52,58.55 | 110.11,11.62 110.36,11.36 | U$4.6 104.52,59.56 C29.+ 104.52,58.55 | 104.52,58.55 104.78,58.55 106.43,56.9 125.73,56.9 C31.+ 129.54,51.69 | C43.1 153.88,44.92 153.03,44.07 v141.86,44.07 132.97,44.07 132.46,44.58 R29.2 | 132.4,46.35 130.18,46.35 129.54,46.99 129.54,51.69 | 129.54,51.69 134.24,51.69 C30.+
  Bottom 0.254: v155.19,46.48 155.19,47.12 154.94,47.37 IC1.8 | T6.E 141.28,43.49 v141.86,44.07
  Bottom 0.406: U$6.8 128.65,53.98 C31.+ | U$5.8 134.75,53.98 C30.+
CLKOUT_ETH_3V  (via drill 0.6)
  Top 0.254: U1.9 20.95,66.29 v19.68,65.02
  Bottom 0.254: v19.68,65.02 13.34,65.02 12.83,64.52 12.83,62.23 12.06,61.47 11.68,61.47 11.05,60.83 JP2.1
CS_ETH  (via drill 0.6)
  Top 0.254: U1.13 40.11,66.95 v40.64,66.42
  Bottom 0.254: U$2.29 48.31,57.4 46.61,57.4 41.4,62.61 41.4,65.66 v40.64,66.42
CS_ETH_3V  (via drill 0.6)
  Top 0.254: U1.8 17.68,66.95 17.14,66.42 v17.14,63.63
  Bottom 0.254: v17.14,63.63 15.62,63.63 13.59,61.59 JP2.2
D2A  (via drill 0.6)
  Top 0.254: v153.16,75.18 113.16,75.18 111.63,76.71 v96.77,76.71 | v77.6,75.31 72.9,75.31 55.88,58.29 v54.74,58.29
  Bottom 0.254: R52.1 v153.16,75.18 | v96.77,76.71 95.38,75.31 v77.6,75.31 | v54.74,58.29 54.74,59.29 U$2.25
GND  (via drill 0.6)
  Top 0.406: v9.02,20.57 8.38,21.21 7.12,21.21 C20.- | D4.A 35.5,18.22 R_ISEN_B.1 33.43,18.12 C_ISEN_B.2 | C11.2 43.31,32.13 v43.05,32.38
  Top 0.813: C20.- 7.11,28.31 C21.-
  Bottom 0.254: 54.09,68.6 U$2.5
  Bottom 0.406: v9.02,20.57 9.4,20.19 U4.6 14.84,20.19 D7.A | U$1.2 37.38,60.58 C28.2 | U$3.10 43.81,31.62 v43.05,32.38 42.55,32.89 U$3.8 | U3.6 44.34,91.44 D6.A
  Bottom 0.813: U$8.3 U$8.5
  other vias: 34.92,30.61 33.02,26.67 34.67,23.11 55.88,67.82 59.05,66.55 21.34,16.51 105.66,86.74 48.9,73.03 48.77,70.61 18.29,66.04 45.34,62.74 65.15,58.67 90.3,72.14 13.08,72.14
  pour Bottom: 0,0 42.8,0 42.8,38.86 51.44,47.5 75.31,47.5 94.87,67.06 116.08,67.06 116.08,58.55 138.81,58.55 138.81,64.77 160.02,64.77 160.02,100.08 147.32,100.08 147.32,92.08 119.89,92.08 119.89,100.08 0,100.08
  pour Top: 0,0 42.8,0 42.8,38.86 51.44,47.5 75.31,47.5 94.87,67.06 116.08,67.06 116.08,64.77 160.02,64.77 160.02,100.08 147.32,100.08 147.32,92.08 119.89,92.08 119.89,100.08 0,100.08
GND1  (via drill 0.6)
  Top 1.016: C9.- 45.34,4.7
  Top 1.778: C13.2 75.81,7.66 X2.1
  other vias: 49.78,27.18 49.15,21.46 48.01,14.35 50.16,4.19 72.64,21.84 44.32,34.67 54.86,37.34
  pour Bottom (isolate 0.406, rank 3): 42.8,0 94.49,0 94.49,66.67 75.31,47.5 51.44,47.5 42.8,38.86
  pour Top (isolate 0.406, rank 3): 42.8,0 94.49,0 94.49,66.67 75.31,47.5 51.44,47.5 42.8,38.86
INT_ETH  (via drill 0.6)
  Top 0.254: v33.15,72.14 32.51,71.5 U1.20
  Bottom 0.254: U$2.30 52.84,63.13 48.13,58.42 46.48,58.42 42.42,62.48 42.42,66.17 36.45,72.14 v33.15,72.14
INT_ETH_3V
  Top 0.254: U1.1 22.99,71.5 21.21,73.28 JP1.5
KICK  (via drill 0.6)
  Top 0.254: v118.49,68.58 90.81,68.58 v76.83,54.61
  Bottom 0.254: 121.28,63.37 R19.1 119.13,65.6 119.13,67.94 v118.49,68.58 | v76.83,54.61 64.61,54.61 U$2.23
KICK_VOLTAGE
  Bottom 0.254: R5.1 151.57,72.84 150.62,73.79 150.62,74.23 R52.2 R21.2 149.67,79.66 C36.1 149.77,79.84 148.34,81.28 IC4.2
LINE  (via drill 0.6)
  Top 0.254: R70.2 v38.23,31.62 38.23,39.03 C48.1 | C48.1 36.57,39.92 T1.3 | v128.27,67.06 117.86,67.06 117.35,67.56 91.69,67.56 77.09,52.96 68.33,52.96 65.41,50.04 51.69,50.04 41.66,40.01 39.2,40.01 C48.1
  Bottom 0.254: U$3.7 v38.23,31.62 | U$6.3 131.19,61.85 130.3,62.74 129.41,62.74 128.86,63.29 T2.3 128.86,66.46 v128.27,67.06
MISO  (via drill 0.6)
  Top 0.254: U1.17 32.08,69.55 v36.45,73.91
  Bottom 0.254: v36.45,73.91 52.15,73.91 U$2.8
MISO_3V
  Top 0.254: U1.4 22.91,69.55 16.13,76.33 JP1.3
MOSI  (via drill 0.6)
  Top 0.254: U1.16 33.22,68.91 v39.62,75.31
  Bottom 0.254: v39.62,75.31 52.86,75.31 U$2.9
MOSI_3V
  Top 0.254: U1.5 22.53,68.91 13.59,77.85 JP1.2
N$1  (via drill 0.6)
  Top 0.406: L5.2 45.65,96.46 v45.72,96.39
  Bottom 0.406: C19.2 49.95,95.59 U3.8 45.85,93.98 | 45.85,93.98 44.09,93.98 D6.K | v45.72,96.39 45.72,94.11 45.85,93.98
N$2  (via drill 0.6)
  Top 0.254: v110.11,2.67 110.62,2.67 110.87,2.92 LED1.C
  Bottom 0.254: VR1.1 109.77,3 v110.11,2.67
N$3
  Bottom 0.254: C19.1 51.65,95.59 U3.1
N$4
  Bottom 0.254: R1.2 U$1.8
N$5  (via drill 0.6)
  Top 0.254: v66.29,76.58 66.67,76.58 Q1.2
  Bottom 0.254: C4.2 66.21,76.49 v66.29,76.58 66.29,76.52 63.88,74.11 U$2.11
N$6  (via drill 0.6)
  Top 0.254: v61.09,76.58 60.58,76.58 Q1.1
  Bottom 0.254: C5.2 61.17,76.49 v61.09,76.58 61.09,72.39 58.46,69.77 U$2.10
N$7
  Bottom 0.254: RF_MAX.1 T8.3
N$8
  Bottom 0.254: R_SS.2 27.94,20.7 27.56,21.08 27.43,25.91 28.07,26.54 29.59,26.54 30.35,27.3 30.35,27.5 RF_MIN.2 33.4,27.81 | U$3.4 33.4,27.81 | RF_MAX.2 33.4,27.81
N$9
  Bottom 0.254: R32.1 SJ1.1
N$10  (via drill 0.6)
  Top 0.254: v58.42,62.99 57.6,63.81 C6.2
  Bottom 0.254: U$2.21 58.49,62.99 v58.42,62.99
N$11
  Bottom 0.254: CF.1 U$3.3
N$12
  Bottom 0.254: 99.31,25.47 R36.2 R33.1 103.25,24.77 105.28,22.73 105.28,8.26 107.13,6.41 VR1.2
N$13
  Bottom 0.254: R105.1 151.89,52.45 152.27,52.07 153.16,52.07 154.31,50.93 154.31,47.5 153.8,46.99 153.8,45.72 154.94,44.58 IC1.1
N$14
  Bottom 0.254: IC1.2 153.67,42.67 154.43,41.91 155.7,41.91 156.08,42.29 156.08,53.15 R11.2 | R11.2 154.24,54.99 154.05,54.99 153.29,55.75 153.29,59.56 152.31,60.54 C14.1 152.27,61.51 152.27,61.72 150.5,63.5 149.35,63.5 148.97,63.88 OK1.7 | C51.1 154.69,54.65 R11.2
N$15
  Bottom 0.254: R101.1 155,33.09 R6.2 154.77,36.93 C15.1 154.77,40.42 152.4,42.8 IC1.3 152.4,46.74 152.02,47.12 151.38,47.12 151.13,47.37 IC1.5 151.1,48.86 C32.1
N$16
  Bottom 0.406: Q3.G 53.4,17.34 R53.1 44.26,17.34 43.94,17.65 43.94,24.89 44.32,25.27 U$3.15
N$17
  Bottom 0.406: U$3.11 47.37,30.35 49.15,28.57 52.32,28.57 53.21,27.69 53.21,27.37 R54.1 53.47,27.11 Q4.G
N$18
  Bottom 0.254: U$3.1 40.51,23.94 40.51,21.08 40.13,20.7 R_SS.1 30.67,18.52 CSS.1
N$19
  Bottom 0.406: U$3.16 48.93,24 C_BOOT.1
N$20
  Bottom 0.254: C_DELAY.1 30.57,25.17 R_DELAY.2 U$3.2
N$21
  Bottom 0.254: OK1.1 150.24,60.26 R105.2
N$22
  Bottom 0.254: OK1.2 OK1.3
N$23
  Top 1.676: R2.2 R3.1
N$24
  Bottom 1.016: R3.2 Q6.D
N$25
  Bottom 0.254: IC1.7 153.67,50.67 152.91,51.44 151.26,51.44 150.88,51.82 150.88,55.18 R9.1
N$26  (via drill 0.6)
  Top 0.406: L6.2 15.68,15.24 v13.46,15.24
  Bottom 0.406: 13.34,17.65 U4.8 10.79,17.6 10.79,16.76 9.78,15.75 C22.2 | 13.34,17.65 15.1,17.65 D7.K | v13.46,15.24 13.46,17.53 13.34,17.65
N$27  (via drill 0.6)
  Top 0.254: v149.73,50.93 149.73,52.92 C46.1 149.77,55.15 R4.2 R7.1
  Bottom 0.254: IC1.6 152.4,50.29 152.15,50.55 150.11,50.55 v149.73,50.93
N$28  (via drill 0.6)
  Top 0.254: v41.78,13.84 40.52,13.84 D3.C
  Top 0.406: D3.C 38.99,15.11 37.72,13.84 34.29,13.84 33.53,14.61 R_ISEN_B.2 33.43,16.42 C_ISEN_B.1
  Bottom 0.254: U$3.6 42.04,30.35 42.42,29.97 42.42,14.48 v41.78,13.84
N$29
  Top 1.422: L4.1 57.13,42.59 L3.1
  Top 3.81: L7.9 84.63,38.69 80.77,42.55 72.69,42.55 L4.1
N$30
  Top 0.406: R59.2 8.06,10.73 11.43,7.37 F1.2
  Top 1.676: X1.1 15.9,7.11 F1.2
N$31
  Top 0.406: R_ISEN_A.1 40.71,19.17 D3.A 38.99,17.65 38.61,17.27 36.83,17.27 36.45,16.89 D4.C
N$32
  Top 0.406: R_ISEN_A.2 43.79,16.7 C_ISEN_A.1
N$33
  Bottom 0.406: C22.1 6.6,15.75 5.97,16.38 5.97,17.6 U4.1
N$34
  Bottom 1.016: D10.K L7.2 114.84,28.57 D8.A
N$35
  Bottom 0.254: OK2.1 144.4,59.69 145.48,58.61 R9.2
N$36
  Bottom 1.016: D9.A 110.68,38.69 L7.4 115.79,38.75 D11.K
N$37  (via drill 0.6)
  Top 0.254: IC2.10 v99.44,82.04
  Bottom 0.254: v99.44,82.04 80.01,82.04 79.45,82.6 U2.1
N$38  (via drill 0.6)
  Top 0.254: IC2.1 v94.23,89.66
  Bottom 0.254: U2.5 89.86,87.45 92.08,89.66 v94.23,89.66
N$39
  Bottom 0.406: Q6.G 140.84,36.96 140.34,37.47 T6.C 140.19,40.58 R12.2
N$40
  Bottom 0.254: U$5.2 136.02,64.45 R14.2
N$41
  Bottom 0.254: R15.1 136.65,55.32
  Bottom 0.305: 136.65,55.32 136.53,55.45
  Bottom 0.406: U$5.7 136.53,55.45 U$5.6
N$42
  Top 0.254: R58.1 96.94,84.65 IC2.5
N$43
  Bottom 0.254: U$6.2 129.92,61.72 129.67,61.98 125.98,61.98 125.09,61.09 R17.1
N$44
  Bottom 0.305: D5.K 130.57,55.34 130.68,55.45
  Bottom 0.406: U$6.7 130.68,55.45 U$6.6 | D5.K 130.57,49.67 129.16,48.26 129.16,44.32 126.49,41.65 R18.1 126.49,40.01
N$46
  Bottom 0.406: T6.B 139.38,45.34 R15.2
N$47
  Bottom 0.254: T2.1 126.72,63.37 R19.2 R51.2
N$48
  Bottom 0.406: Q2.G 135.76,25.91 134.11,27.56 134.11,37.21 132.08,39.24 132.08,40 R18.2 R13.2
N$49
  Top 2.184: COIL_IN.P$1 130.18,10.41 U$7.A Q2.D R20.2
N$50  (via drill 0.6)
  Top 0.254: v144.02,82.17 141.48,79.63 124.08,79.63 123.19,80.52 123.19,87.88 120.4,90.68 v111.38,90.68
  Bottom 0.254: IC4.1 144.4,82.55 v144.02,82.17 | U2.6 93.93,86.82 97.79,90.68 v111.38,90.68
N$51
  Bottom 0.254: U$2.22 62.78,57.57 R55.1
N$52
  Top 0.254: R25.2 51.67,52.75 T4.1
N$53
  Bottom 0.406: D5.A 126.47,44.2 R13.1
N$54
  Bottom 0.254: Q5.1 73.53,9.52 74.93,10.92 79.31,10.92 R200.1
  Bottom 0.305: D13.C 79.82,14.3 R200.1
N$55
  Bottom 0.305: T3.3 76.48,15.35 D13.A
N$56
  Bottom 0.254: T3.1 77.4,12.76 76.45,11.81 73.79,11.81 70.29,15.31 R24.2
N$58  (via drill 0.6)
  Top 0.254: R26.1 51.67,54.95 T4.3 56.73,54.95 v72.39,70.61
  Bottom 0.254: U2.2 78.03,86.16 72.39,80.52 v72.39,70.61
N$59
  Bottom 0.254: U$2.17 62.63,63.37 64.06,63.37 R57.1
N$60
  Bottom 0.254: R37.2 R34.1 103.25,20.07 104.65,18.67 104.65,6.45 VR2.2
N$61
  Bottom 0.254: R35.1 R38.2 99.61,16.15 VR3.2
N$62  (via drill 0.6)
  Top 0.254: LED2.C 108.33,3.43 v107.7,2.79
  Bottom 0.254: VR2.1 104.69,3.13 105.03,2.79 v107.7,2.79
N$63  (via drill 0.6)
  Top 0.254: LED3.C 105.79,3.43 105.16,2.79 v100.2,2.79
  Bottom 0.254: VR3.1 99.61,3.39 v100.2,2.79
N$64
  Top 0.406: R39.1 LED1.A
N$65
  Top 0.406: R40.1 LED2.A
N$66
  Top 0.406: R41.1 LED3.A
N$67
  Top 0.254: R42.1 LED4.A
N$69
  Top 0.406: D15.K 16.62,86.89 | 16.62,86.89 13.84,89.66 13.84,90.55 16.26,92.96 16.26,93.47 U$8.2 | L1.2 23.18,86.42 22.73,86.87 16.64,86.87 16.62,86.89
N$70
  Bottom 0.813: T5.1 72.16,91.92 JP3.3
N$71
  Top 0.254: R45.1 LED7.A
N$72
  Top 0.254: R43.1 LED5.A
N$73
  Top 0.254: R44.1 LED6.A
N$74
  Top 0.305: R46.1 LED8.A
N$75
  Bottom 0.254: R16.2 R47.2 72.45,85.28 73.13,85.95 T5.3
N$76
  Top 0.406: R49.1 LED9.A
N$77
  Top 0.254: R59.1 6.16,9.33 11.4,4.1 LED10.A
N$78
  Top 0.254: T1.1 39.56,44.16 R61.2
N$79
  Bottom 0.254: T8.1 30.5,54.44 R48.2 28.17,54.29 C49.1
NOTAUS  (via drill 0.6)
  Top 0.254: v136.14,68.45 133.22,71.37 101.09,71.37 100.71,70.99 91.19,70.99 90.61,70.42 | 90.61,70.42 76.2,56.01 v69.98,56.01 65.02,51.05 51.31,51.05 44.7,44.45 R61.1 | v88.27,85.09 88.27,72.77 90.61,70.42
  Bottom 0.254: v136.14,68.45 R14.1 | v88.27,85.09 87.2,86.16 U2.7 | R55.2 64.9,56.01 v69.98,56.01
OC0A/MOSI_A  (via drill 0.6)
  Top 0.254: SV1.1 30.86,40.01 30.86,42.93 49.78,61.85 v49.78,67.44 v49.78,80.64
  Bottom 0.254: v49.78,67.44 51.69,67.44 52.23,66.9 U$2.2 | JP4.1 58.17,89.03 v49.78,80.64
OC1A_FREQ/MISO_A  (via drill 0.6)
  Top 0.254: SV1.9 46.35,65.66 v48.26,65.66
  Bottom 0.254: v48.26,65.66 51.08,65.66 U$2.1 | SV1.9 29.34,51.37 R48.1
RESET_NOTAUS  (via drill 0.6)
  Top 0.254: IC2.15 108.84,88.39 109.22,88.01 109.22,83.69 108.84,83.31 IC2.11 v100.97,83.31 | v60.58,57.15 68.71,65.28 72.26,65.28 v86.61,79.63
  Bottom 0.254: v100.97,83.31 100.97,80.9 100.58,80.52 87.5,80.52 v86.61,79.63 | U$2.24 60.58,57.51 v60.58,57.15
RST  (via drill 0.6)
  Top 0.254: SV1.5 40.51,54.74 40.51,55.63 v46.23,61.34
  Bottom 0.254: U$2.31 49.98,61.34 v46.23,61.34
RST_ETH  (via drill 0.6)
  Top 0.254: U1.14 38.66,67.61 v41.15,70.1
  Bottom 0.254: U$2.32 50.76,63.25 48.01,63.25 43.94,67.31 43.69,67.56 v41.15,70.1
RST_ETH_3V
  Top 0.254: U1.7 16.82,67.61 16.13,66.93 JP2.3
SCK  (via drill 0.6)
  Top 0.254: U1.15 36.75,68.25 v37.21,68.71
  Bottom 0.254: U$2.28 48.42,56.39 46.23,56.39 38.48,64.14 38.48,68.33 38.1,68.71 v37.21,68.71
SCK_3V
  Top 0.254: U1.6 22.17,68.25 14.35,76.07 11.3,76.07 11.05,76.33 JP1.1
SERVO_PWM  (via drill 0.6)
  Top 0.254: v51.31,68.45 v51.31,78.36
  Bottom 0.254: U$2.3 52.8,67.47 51.82,68.45 v51.31,68.45 | v51.31,78.36 51.31,79.12 60.96,88.77 66.42,88.77 67.06,89.41 JP3.1
STBY  (via drill 0.6)
  Top 0.254: v64.9,65.28 v57.4,57.78
  Bottom 0.254: U$3.5 C12.1 36.66,40.35 52.83,56.52 56.13,56.52 v57.4,57.78 | U2.3 77.55,86.82 71.63,80.9 71.63,72.01 v64.9,65.28 67.22,62.95 R57.2
TASTER
  Top 0.254: IC2.14 99.69,87.12 99.31,87.5 99.31,92.16 C33.1 99.33,92.23 | S1.4 99.33,92.23 | 99.33,92.23 99.33,94.41 R22.2
  Bottom 0.406: S1.3 S1.4
TRAFO1
  Top 1.676: Q3.S 58.55,18.54 56.01,21.08 Q4.D 56.01,24.77 57.66,26.42 69.77,26.42 L4.2
  Bottom 0.406: U$3.14 48.09,26.54 C_BOOT.2 49.31,25.36 50.55,24.13 50.55,19.81 | Q4.D 56.01,21.46 54.61,20.07 50.8,20.07 50.55,19.81 | 50.55,19.81 R53.2
TRAFO2
  Top 0.406: C_ISEN_A.2 57.19,31.75 60.96,31.75 61.31,32.1 L3.2
  Top 1.016: L7.11 86.1,27.69 78.87,34.92 64.07,34.92 L3.2
  Top 1.778: L7.11 86.24,27.69 80.9,20.7 C13.1
WOL_ETH_3V
  Top 0.254: U1.3 23.27,70.21 18.67,74.8 JP1.4
ÜBERSPANNUNG  (via drill 0.6)
  Top 0.254: v139.32,76.83 123.06,76.83 121.03,78.87 121.03,86.36 120.27,87.12 v112.01,87.12 | v106.55,84.58 IC2.12
  Bottom 0.254: OK2.7 143.13,70.87 142.49,71.5 C24.1 140.78,71.6 R10.2 140.78,75.38 v139.32,76.83 | v112.01,87.12 107.53,87.12 C41.1 107.19,85.22 v106.55,84.58